# EAGLE design robot (EAGLE 9.6.0)
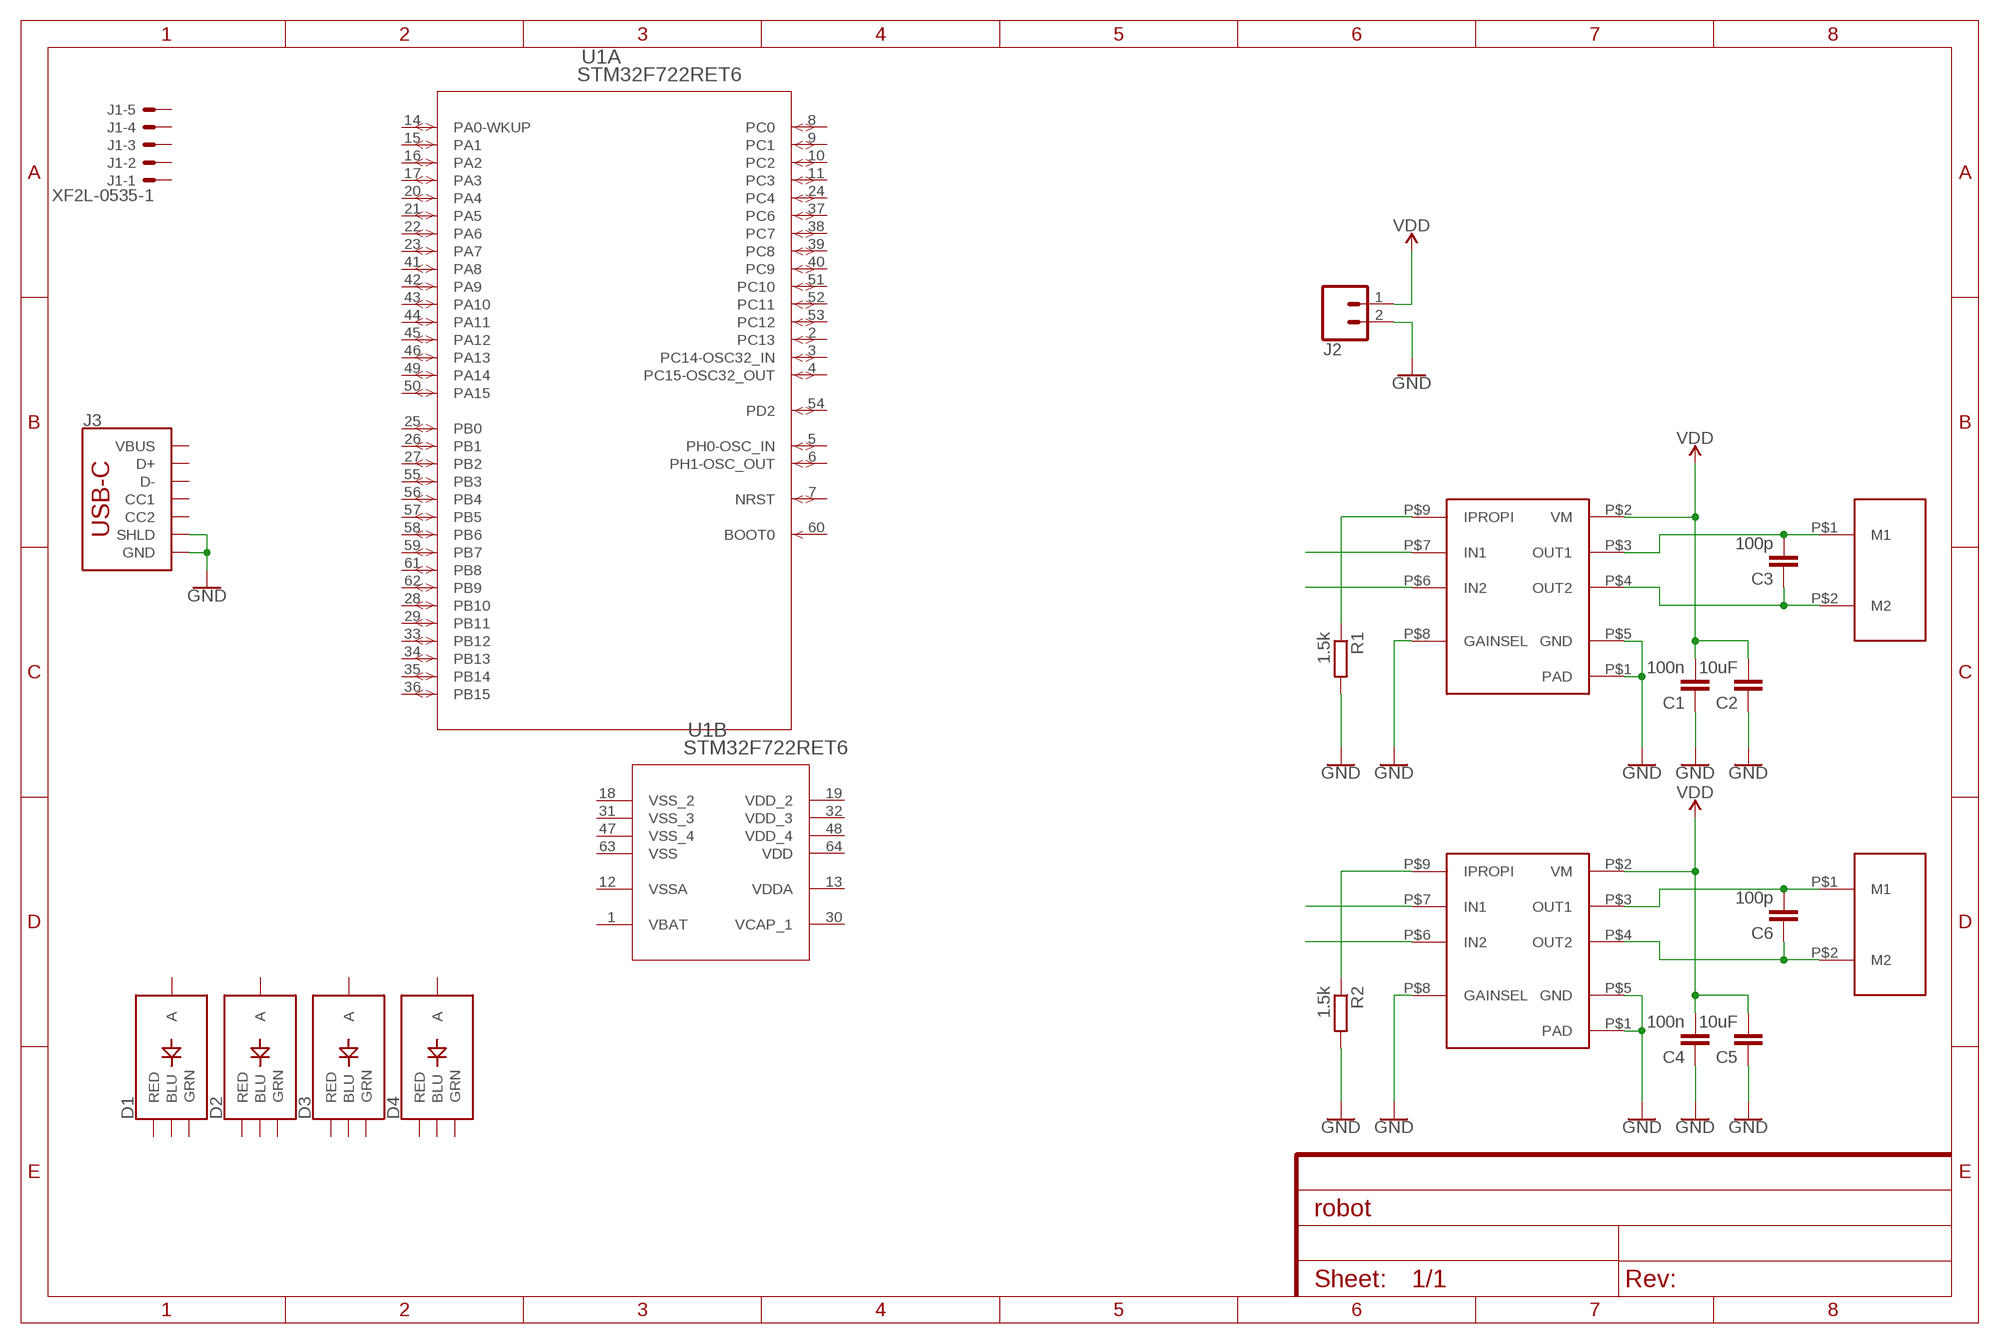
[diagram p0: schematic, sheet 1]

## Parts
C1  100n  C-EUC0805  [C0805]
C2  10uF  C-EUC0805  [C0805]
C3  100p  C-EUC0805  [C0805]
C4  100n  C-EUC0805  [C0805]
C5  10uF  C-EUC0805  [C0805]
C6  100p  C-EUC0805  [C0805]
D1  LED-RGB-CASMD  [LED-TRICOLOR-SMD]
D2  LED-RGB-CASMD  [LED-TRICOLOR-SMD]
D3  LED-RGB-CASMD  [LED-TRICOLOR-SMD]
D4  LED-RGB-CASMD  [LED-TRICOLOR-SMD]
J1  XF2L-0535-1  [XF2L-0535-1]
J2  CONN_02  [1X02]
J3  USB_C_2-LAYER_PADS  [USB-C-16P-2LAYER-PADS]
R1  1.5k  R-EU_M0805  [M0805]
R2  1.5k  R-EU_M0805  [M0805]
U1  STM32F722RET6  [LQFP64-10X10MM]
U$1  POLOLU_MICRO_METAL_GEAR_MOTOR  [POLOLU_MICRO_METAL_GEAR_MOTOR]
U$2  POLOLU_MICRO_METAL_GEAR_MOTOR  [POLOLU_MICRO_METAL_GEAR_MOTOR]
U$3  DRV8213  [DSG8]
U$4  DRV8213  [DSG8]

## Nets
GND: C1.1 C2.1 C4.1 C5.1 J2.2 J3.GND J3.GND2(GND) J3.SHLD1(SHLD) J3.SHLD2(SHLD) J3.SHLD3(SHLD) J3.SHLD4(SHLD) R1.2 R2.2 U$3.P$1(PAD) U$3.P$5(GND) U$3.P$8(GAINSEL) U$4.P$1(PAD) U$4.P$5(GND) U$4.P$8(GAINSEL)
N$1: U$3.P$7(IN1)
N$2: U$3.P$6(IN2)
N$3: R1.1 U$3.P$9(IPROPI)
N$4: U$4.P$7(IN1)
N$5: C3.1 U$1.P$2(M2) U$3.P$4(OUT2)
N$6: C3.2 U$1.P$1(M1) U$3.P$3(OUT1)
N$7: U$4.P$6(IN2)
N$8: R2.1 U$4.P$9(IPROPI)
N$9: C6.1 U$2.P$2(M2) U$4.P$4(OUT2)
N$10: C6.2 U$2.P$1(M1) U$4.P$3(OUT1)
VDD: C1.2 C2.2 C4.2 C5.2 J2.1 U$3.P$2(VM) U$4.P$2(VM)
Unconnected: D1.A D1.B(BLU) D1.G(GRN) D1.R(RED) D2.A D2.B(BLU) D2.G(GRN) D2.R(RED) D3.A D3.B(BLU) D3.G(GRN) D3.R(RED) D4.A D4.B(BLU) D4.G(GRN) D4.R(RED) J1.1 J1.2 J1.3 J1.4 J1.5 J3.A5(CC1) J3.A6(D+) J3.A7(D-) J3.B5(CC2) J3.B6(D+) J3.B7(D-) J3.VBUS1(VBUS) J3.VBUS2(VBUS) U1.2(A:PC13) U1.3(A:PC14-OSC32_IN) U1.4(A:PC15-OSC32_OUT) U1.5(A:PH0-OSC_IN) U1.6(A:PH1-OSC_OUT) U1.7(A:NRST) U1.8(A:PC0) U1.9(A:PC1) U1.10(A:PC2) U1.11(A:PC3) U1.14(A:PA0-WKUP) U1.15(A:PA1) U1.16(A:PA2) U1.17(A:PA3) U1.20(A:PA4) U1.21(A:PA5) U1.22(A:PA6) U1.23(A:PA7) U1.24(A:PC4) U1.25(A:PB0) U1.26(A:PB1) U1.27(A:PB2) U1.28(A:PB10) U1.29(A:PB11) U1.33(A:PB12) U1.34(A:PB13) U1.35(A:PB14) U1.36(A:PB15) U1.37(A:PC6) U1.38(A:PC7) U1.39(A:PC8) U1.40(A:PC9) U1.41(A:PA8) U1.42(A:PA9) U1.43(A:PA10) U1.44(A:PA11) U1.45(A:PA12) U1.46(A:PA13) U1.49(A:PA14) U1.50(A:PA15) U1.51(A:PC10) U1.52(A:PC11) U1.53(A:PC12) U1.54(A:PD2) U1.55(A:PB3) U1.56(A:PB4) U1.57(A:PB5) U1.58(A:PB6) U1.59(A:PB7) U1.60(A:BOOT0) U1.61(A:PB8) U1.62(A:PB9)

## Power pins joined to a net without a drawn wire
VBAT: U1.1(B:VBAT)
VCAP_1: U1.30(B:VCAP_1)
VDD: U1.64(B:VDD)
VDD_2: U1.19(B:VDD_2)
VDD_3: U1.32(B:VDD_3)
VDD_4: U1.48(B:VDD_4)
VDDA: U1.13(B:VDDA)
VSS: U1.63(B:VSS)
VSS_2: U1.18(B:VSS_2)
VSS_3: U1.31(B:VSS_3)
VSS_4: U1.47(B:VSS_4)
VSSA: U1.12(B:VSSA)

## Library data of the parts
C1-C6 = rcl:C-EU: CAPACITOR, European symbol; SPICEPREFIX: C
D1-D4 = SparkFun-LED:LED-RGB-CA: LED-RGB Diffused Common Anode Packages: LED RGB-THRU P-LCC-4-3 LED-TRICOLOR-SMD SparkFun Products: RGB Diffused Common Anode- Diffuse <[https://www.sparkfun.com/products/10821]> RGB Diffused Common Anode - Clear <[https://www.sparkfun.com/products/10820]> Qduino Mini <[https://www.sparkfun.com/products/13614]> Triple Output LED RGB - SMD <https://www.sparkfun.com/products/7844>; PROD_ID: DIO-08324
J1 = con-omron:XF2*-05?: OMRON FPC Connector Source : http://www.omron.com/ecb/products/pdf/fpc.pdf; MPN: XF2L-0535-1A; OC_FARNELL: unknown; OC_NEWARK: 37M0863
J2 = SparkFun-Connectors:CONN_02: Multi connection point. Often used as Generic Header-pin footprint for 0.1 inch spaced/style header connections On any of the 0.1 inch spaced packages, you can populate with these: Break Away Headers - Straight <https://www.sparkfun.com/products/116> (PRT-00116) Break Away Male Headers - Right Angle <https://www.sparkfun.com/products/553> (PRT-00553) Female Headers <https://www.sparkfun.com/products/115> (PRT-00115) Break Away Headers - Machine Pin <https://www.sparkfun.com/products/117> (PRT-00117) Break Away Female Headers - Swiss Machine Pin <https://www.sparkfun.com/products/743> (PRT-00743) For SCREWTERMINALS and SPRING TERMINALS visit here: Screw Terimnals on SparkFun.com <https://www.sparkfun.com/search/results?term=Screw+Terminals> (5mm/3.5mm/2.54mm spacing) This device is also useful as a general connection point to wire up your design to another part of your project. Our various solder wires solder well into these plated through hole pads. Hook-Up Wire - Assortment (Stranded, 22 AWG) <https://www.sparkfun.com/products/11375> (PRT-11375) Hook-Up Wire - Assortment (Solid Core, 22 AWG) <https://www.sparkfun.com/products/11367> (PRT-11367) View the entire wire category on our website here <https://www.sparkfun.com/categories/141> Special notes: Molex polarized connector foot print use with: PRT-08233 with associated crimp pins and housings. 2.54_SCREWTERM for use with PRT-10571. 3.5mm Screw Terminal footprints for PRT-08084 5mm Screw Terminal footprints for use with PRT-08432
J3 = SparkFun-Connectors:USB_C: USB Type C 16Pin Connector Super Speed pins not available on the 16-pin purely SMD connector so this part is best for USB 2.0 implementations. D1 and D2 are tied together enabling D+/- no matter which way the cable is plugged into the connector. The two channel configuration pins (CC1/2) are exposed. These are normally connected to ground via 5.1k resistors but can be reconfigured for high current/high power applications.; PROD_ID: CONN-14122
R1 R2 = rcl:R-EU_: RESISTOR, European symbol; SPICEPREFIX: R
U1 = my_library:STM32F722RET6; COPYRIGHT: Copyright (C) 2024 Ultra Librarian. All rights reserved.; MANUFACTURER_PART_NUMBER: STM32F722RET6; MFR_NAME: STMicroelectronics
U$1 U$2 = my_library:POLOLU_MICRO_METAL_GEAR_MOTOR
U$3 U$4 = my_library:DRV8213

## Board
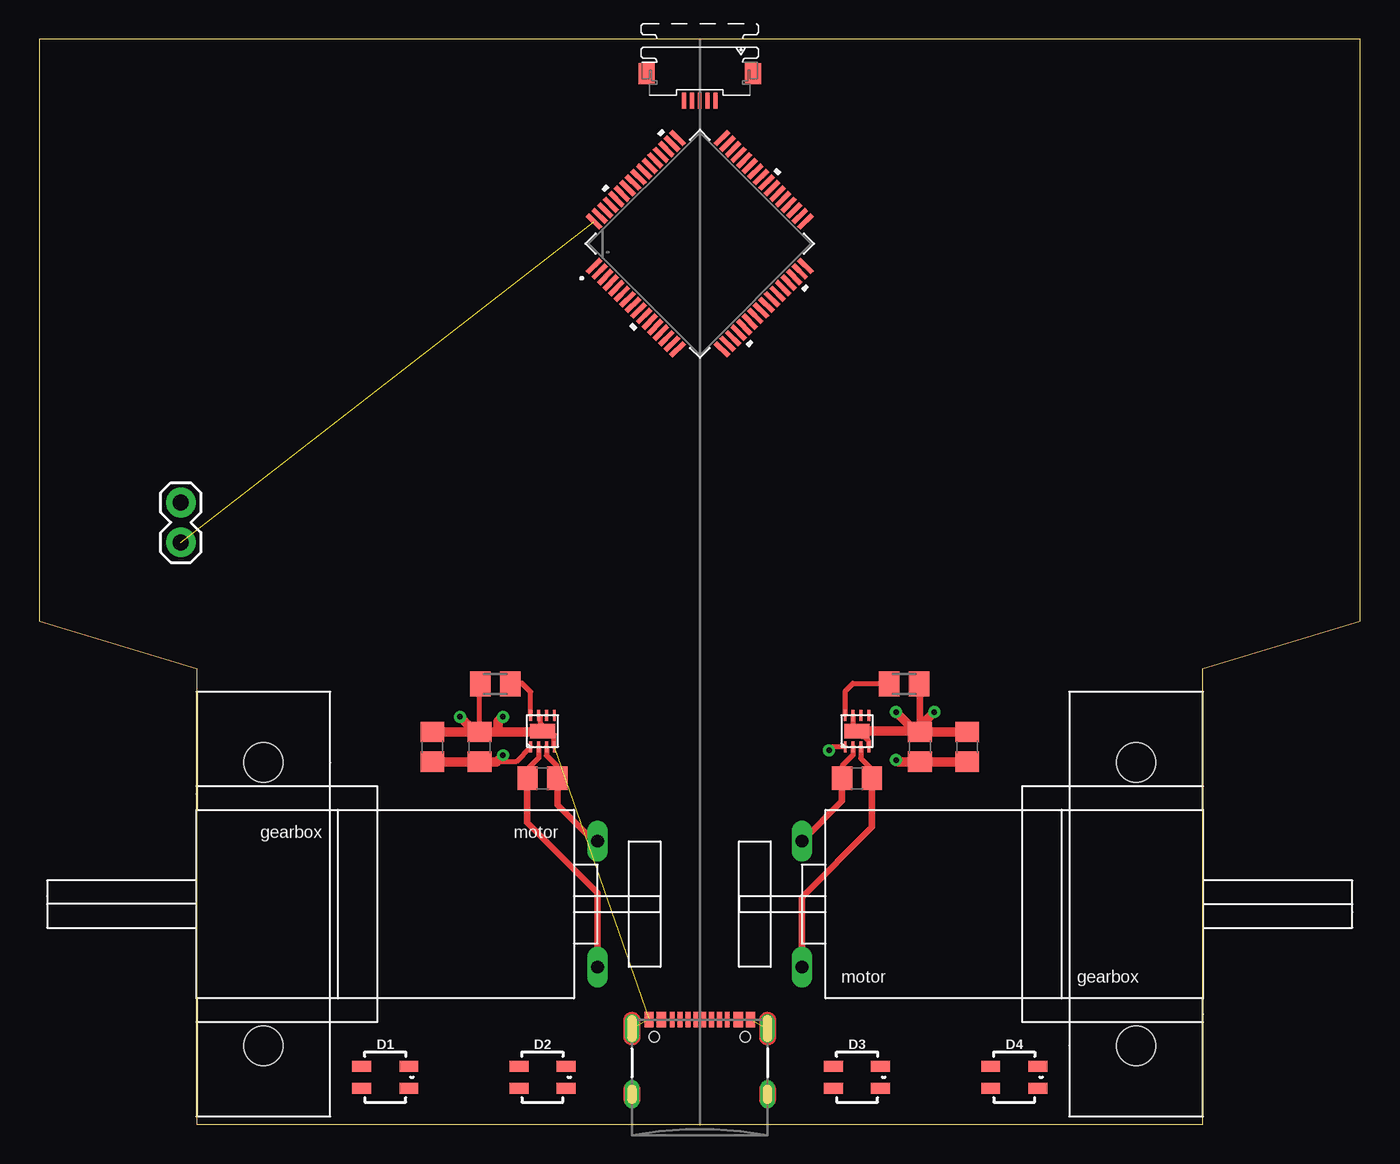
[diagram p1: board, top side]
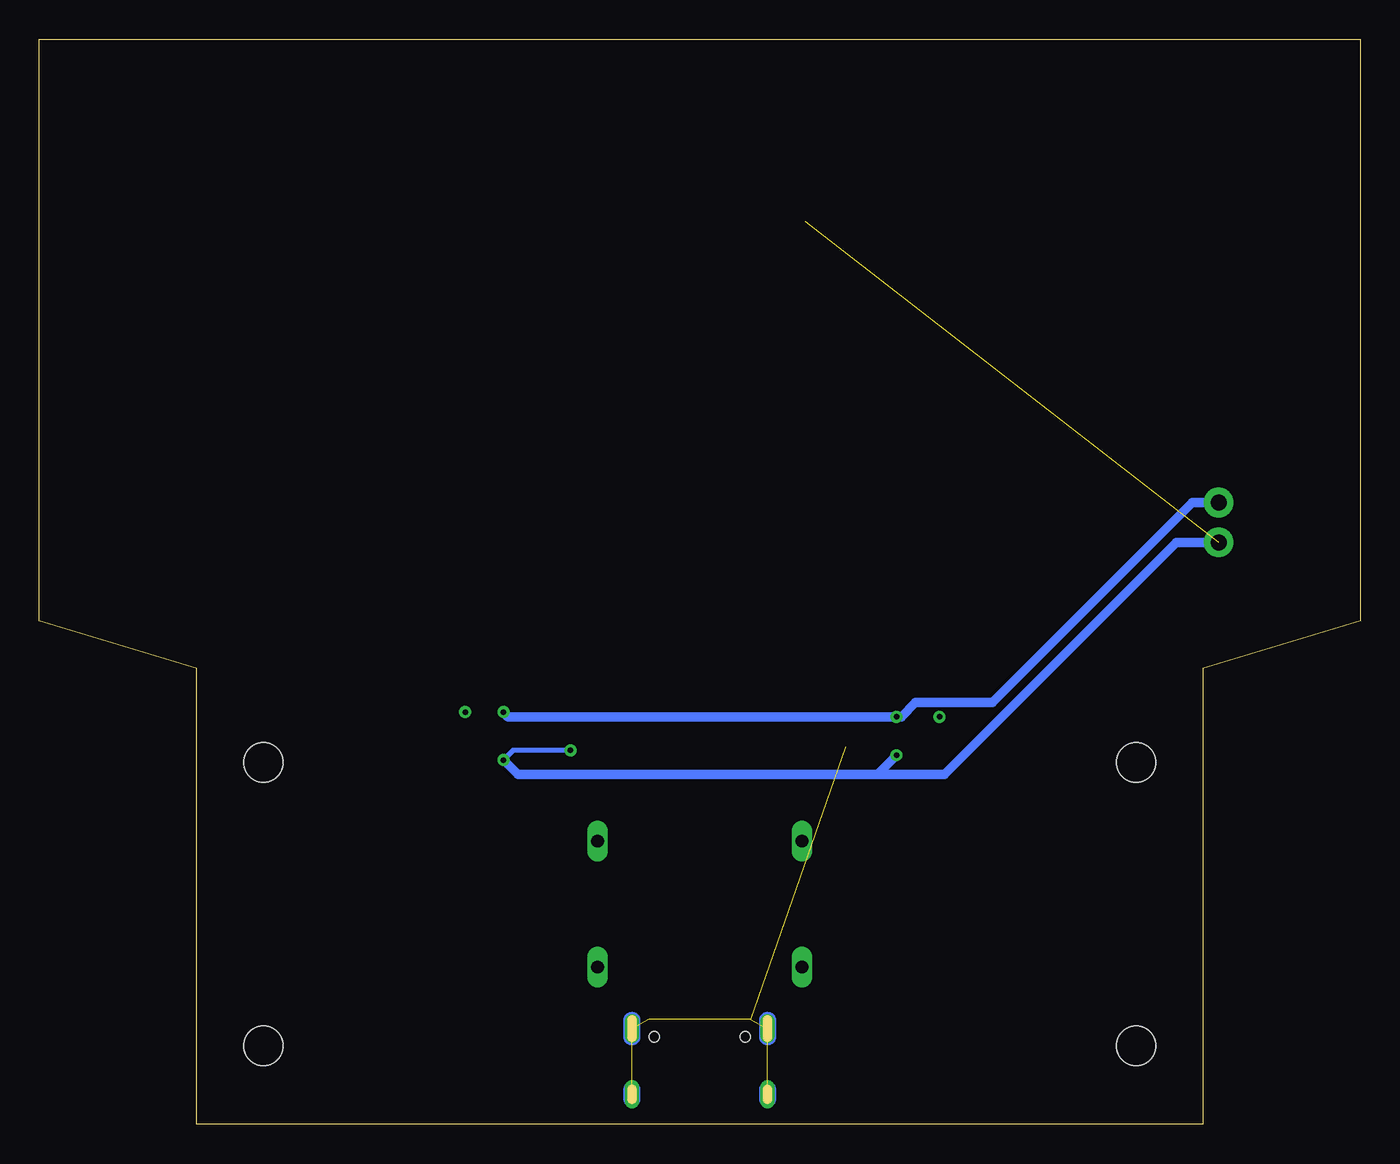
[diagram p2: board, bottom side, seen from below]

Size 84 x 69 mm. Coordinates in mm from the lower left corner, seen from the top.
Outline: 10,0 74,0 74,29 84,32 84,37 84,69 0,69 0,42 0,32 10,29 10,0
Copper layers (1*16): Top 0.035mm / dielectric 1.5mm / Bottom 0.035mm
Design rules "default": minimum track width 6mil, minimum drill 0.35mm, track to track 6mil, track to pad 6mil, pad to pad 6mil, via to via 6mil, smd to smd 6mil, copper to edge 40mil, drill to drill 6mil, minimum pad ring 10mil, minimum via ring 8mil, stop-mask expansion 4mil, vias tented up to drill 0mil, thermal gap 10mil

### Footprints (pad centres in the part's own frame; a part is rotated, then mirrored left to right if it is on the bottom)
C0805 = smd 1.3 x 1.5: 1 -0.95,0; 2 0.95,0
LED-TRICOLOR-SMD = smd 1.2 x 0.7: A 1.5,0.7; B -1.5,0.7; G -1.5,-0.7; R 1.5,-0.7
XF2L-0535-1 = smd 1 x 0.25: 1 1.905,1; 2 1.905,0.5; 3 1.905,0; 4 1.905,-0.5; 5 1.905,-1 | smd 1.34 x 1: M1 0.18,3.388; M2 0.18,-3.388
1X02 = drill 1.016 pad 1.88: 1 0,0; 2 2.54,0
USB-C-16P-2LAYER-PADS = smd 0.3 x 1: A5 -1.25,-0.34; A6 -0.25,-0.34; A7 0.25,-0.34; A8 1.25,-0.34; B5 1.75,-0.34; B6 0.75,-0.34; B7 -0.75,-0.34; B8 -1.75,-0.34 | smd 0.6 x 1: GND -3.225,-0.34; GND2 3.225,-0.34; VBUS1 -2.45,-0.34; VBUS2 2.45,-0.34 | drill 0.4 pad 0.6 long: SHLD1 -4.318,-0.915; SHLD2 4.318,-0.915; SHLD3 -4.318,-5.095; SHLD4 4.318,-5.095 | hole 0.65: -2.89,-1.445; 2.89,-1.445
M0805 = smd 1.3 x 1.6: 1 -0.95,0; 2 0.95,0
LQFP64-10X10MM = smd 1.194 x 0.305: 1 -5.75,3.75; 2 -5.75,3.25; 3 -5.75,2.75; 4 -5.75,2.25; 5 -5.75,1.75; 6 -5.75,1.25; 7 -5.75,0.75; 8 -5.75,0.25; 9 -5.75,-0.25; 10 -5.75,-0.75; 11 -5.75,-1.25; 12 -5.75,-1.75; 13 -5.75,-2.25; 14 -5.75,-2.75; 15 -5.75,-3.25; 16 -5.75,-3.75; 33 5.75,-3.75; 34 5.75,-3.25; 35 5.75,-2.75; 36 5.75,-2.25; 37 5.75,-1.75; 38 5.75,-1.25; 39 5.75,-0.75; 40 5.75,-0.25; 41 5.75,0.25; 42 5.75,0.75; 43 5.75,1.25; 44 5.75,1.75; 45 5.75,2.25; 46 5.75,2.75; 47 5.75,3.25; 48 5.75,3.75 | smd 0.305 x 1.194: 17 -3.75,-5.75; 18 -3.25,-5.75; 19 -2.75,-5.75; 20 -2.25,-5.75; 21 -1.75,-5.75; 22 -1.25,-5.75; 23 -0.75,-5.75; 24 -0.25,-5.75; 25 0.25,-5.75; 26 0.75,-5.75; 27 1.25,-5.75; 28 1.75,-5.75; 29 2.25,-5.75; 30 2.75,-5.75; 31 3.25,-5.75; 32 3.75,-5.75; 49 3.75,5.75; 50 3.25,5.75; 51 2.75,5.75; 52 2.25,5.75; 53 1.75,5.75; 54 1.25,5.75; 55 0.75,5.75; 56 0.25,5.75; 57 -0.25,5.75; 58 -0.75,5.75; 59 -1.25,5.75; 60 -1.75,5.75; 61 -2.25,5.75; 62 -2.75,5.75; 63 -3.25,5.75; 64 -3.75,5.75
POLOLU_MICRO_METAL_GEAR_MOTOR = drill 0.8 long: P$1 -1.5,4; P$2 -1.5,-4 | hole 2.5: 19.75,9; 19.75,-9
DSG8 = smd 0.9 x 1.6: P$1 0,0 | smd 0.7 x 0.18: P$2 -1,0.75; P$3 -1,0.25; P$4 -1,-0.25; P$5 -1,-0.75; P$6 1,-0.75; P$7 1,-0.25; P$8 1,0.25; P$9 1,0.75

### Placement (x,y rotation side)
C1  59,24 270 top
C2  56,24 270 top
C3  52,22 180 top
C4  28,24 270 top
C5  25,24 270 top
C6  32,22 180 top
D1  22,3 0 top
D2  32,3 0 top
D3  52,3 0 top
D4  62,3 0 top
J1  42,67 270 top
J2  9,37 90 top
J3  42,7 0 top
R1  55,28 0 top
R2  29,28 180 top
U1  42,56 45 top
U$1  50,14 0 top
U$2  34,14 180 top
U$3  52,25 90 top
U$4  32,25 90 top

### Tracks (layer width: path | path; a pad name or v marks a point on that pad's centre or on a via)
GND  (via drill 0.35)  (6 unrouted)
  Top 0.305: U$4.P$5 32.75,24.78 32.53,25 U$4.P$1 32,25.38 31.85,25.52 31.85,25.89 U$4.P$8 | 52.05,24.95 52.34,24.66 52.47,24.66 52.75,24.37 U$3.P$5 | U$3.P$8 51.75,25.25 52.03,24.97 | C4.1 28,27.95 R2.2
  Top 0.406: R1.2 56,27.95 C2.1 52.05,24.95 52.03,24.97 U$3.P$1
  Top 0.61: C1.1 C2.1 | C5.1 C4.1 | U$4.P$1 31.95,24.95 29.19,24.95 | 29.19,24.95 C4.1 | U$3.P$1 55.95,25 C2.1 | 29.19,24.95 29.19,25.6 v29.49,25.91 | v54.48,26.21 55.75,24.95 C2.1 | v26.75,25.91 27.7,24.95 C4.1 | v56.92,26.21 56,25.29 C2.1
  Bottom 0.61: v29.49,25.91 32.54,25.91 | 32.54,25.91 54.18,25.91 v54.48,26.21 | 32.54,25.91 29.19,25.91 28.27,26.82 23.39,26.82 10.68,39.54 J2.2
N$3
  Top 0.305: U$3.P$9 51.25,27.55 51.74,28.04 54.01,28.04 R1.1
N$5
  Top 0.305: U$3.P$4 52.25,23.27 52.96,22.55 C3.1
  Top 0.406: U$1.P$2 48.5,14.44 52.96,18.9 C3.1
N$6
  Top 0.305: U$3.P$3 51.75,23.48 51.05,22.78 C3.2
  Top 0.406: U$1.P$1 51.05,20.55 C3.2
N$8
  Top 0.305: U$4.P$9 31.25,27.5 30.71,28.04 29.99,28.04 R2.1
N$9
  Top 0.305: U$4.P$4 32.25,23.45 32.95,22.75 C6.1
  Top 0.406: U$2.P$2 35.27,18 32.95,20.32 C6.1
N$10
  Top 0.305: U$4.P$3 31.75,23.29 31.01,22.55 31.01,22.04 C6.2
  Top 0.406: U$2.P$1 35.5,14.72 31.01,19.2 31.01,22.04
VDD  (via drill 0.35)  (1 unrouted)
  Top 0.305: U$4.P$2 30.3,23.05 30.27,23.05 C4.2 | U$3.P$2 50.44,24 v50.22,23.77 | 55.88,23.16 C2.2
  Top 0.61: v54.48,23.16 54.6,23.05 C2.2 C1.2 | v29.49,23.47 29.07,23.05 C4.2 C5.2
  Bottom 0.305: v50.22,23.77 53.87,23.77 v54.48,23.16
  Bottom 0.61: v54.48,23.16 53.57,22.25 35.89,22.25 | 35.89,22.25 34.98,22.25 30.71,22.25 v29.49,23.47 | 35.89,22.25 26.44,22.25 11.69,37 J2.1